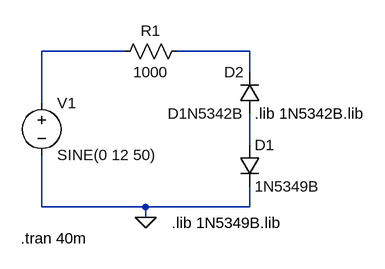
[diagram p0: schematic simulacion3-2.asc]
simulacion3-2.asc, the LTspice schematic file:
Version 4.1
SHEET 1 880 680
WIRE 144 48 16 48
WIRE 336 48 224 48
WIRE 336 80 336 48
WIRE 16 128 16 48
WIRE 336 192 336 144
WIRE 16 288 16 208
WIRE 176 288 16 288
WIRE 336 288 336 256
WIRE 336 288 176 288
WIRE 176 304 176 288
FLAG 176 304 0
SYMBOL voltage 16 112 R0
WINDOW 123 0 0 Left 0
WINDOW 39 0 0 Left 0
SYMATTR InstName V1
SYMATTR Value SINE(0 12 50)
SYMBOL res 240 32 R90
WINDOW 0 0 56 VBottom 2
WINDOW 3 32 56 VTop 2
SYMATTR InstName R1
SYMATTR Value 1000
SYMBOL diode 320 192 R0
SYMATTR InstName D1
SYMATTR Value 1N5349B
SYMBOL diode 352 144 R180
WINDOW 0 24 64 Left 2
WINDOW 3 24 0 Left 2
SYMATTR InstName D2
SYMATTR Value D1N5342B
TEXT 216 312 Left 2 !.lib 1N5349B.lib
TEXT 344 144 Left 2 !.lib 1N5342B.lib
TEXT -16 336 Left 2 !.tran 40m

The netlist it stands for:
* simulacion3-2.asc
V1 N001 0 SINE(0 12 50)
R1 N002 N001 1000
D1 N003 0 1N5349B
D2 N003 N002 D1N5342B
.model D D
.lib standard.dio
.lib 1N5349B.lib
.lib 1N5342B.lib
.tran 40m
.backanno
.end